# Altium schematic sheet 11-DPLL-2.SchDoc
size B; SheetNumber: 10; SheetTotal: 12; SPICEModelCacheYEUHMWUF: <root> / <DocumentId>YEUHMWUF</DocumentId> / </root>
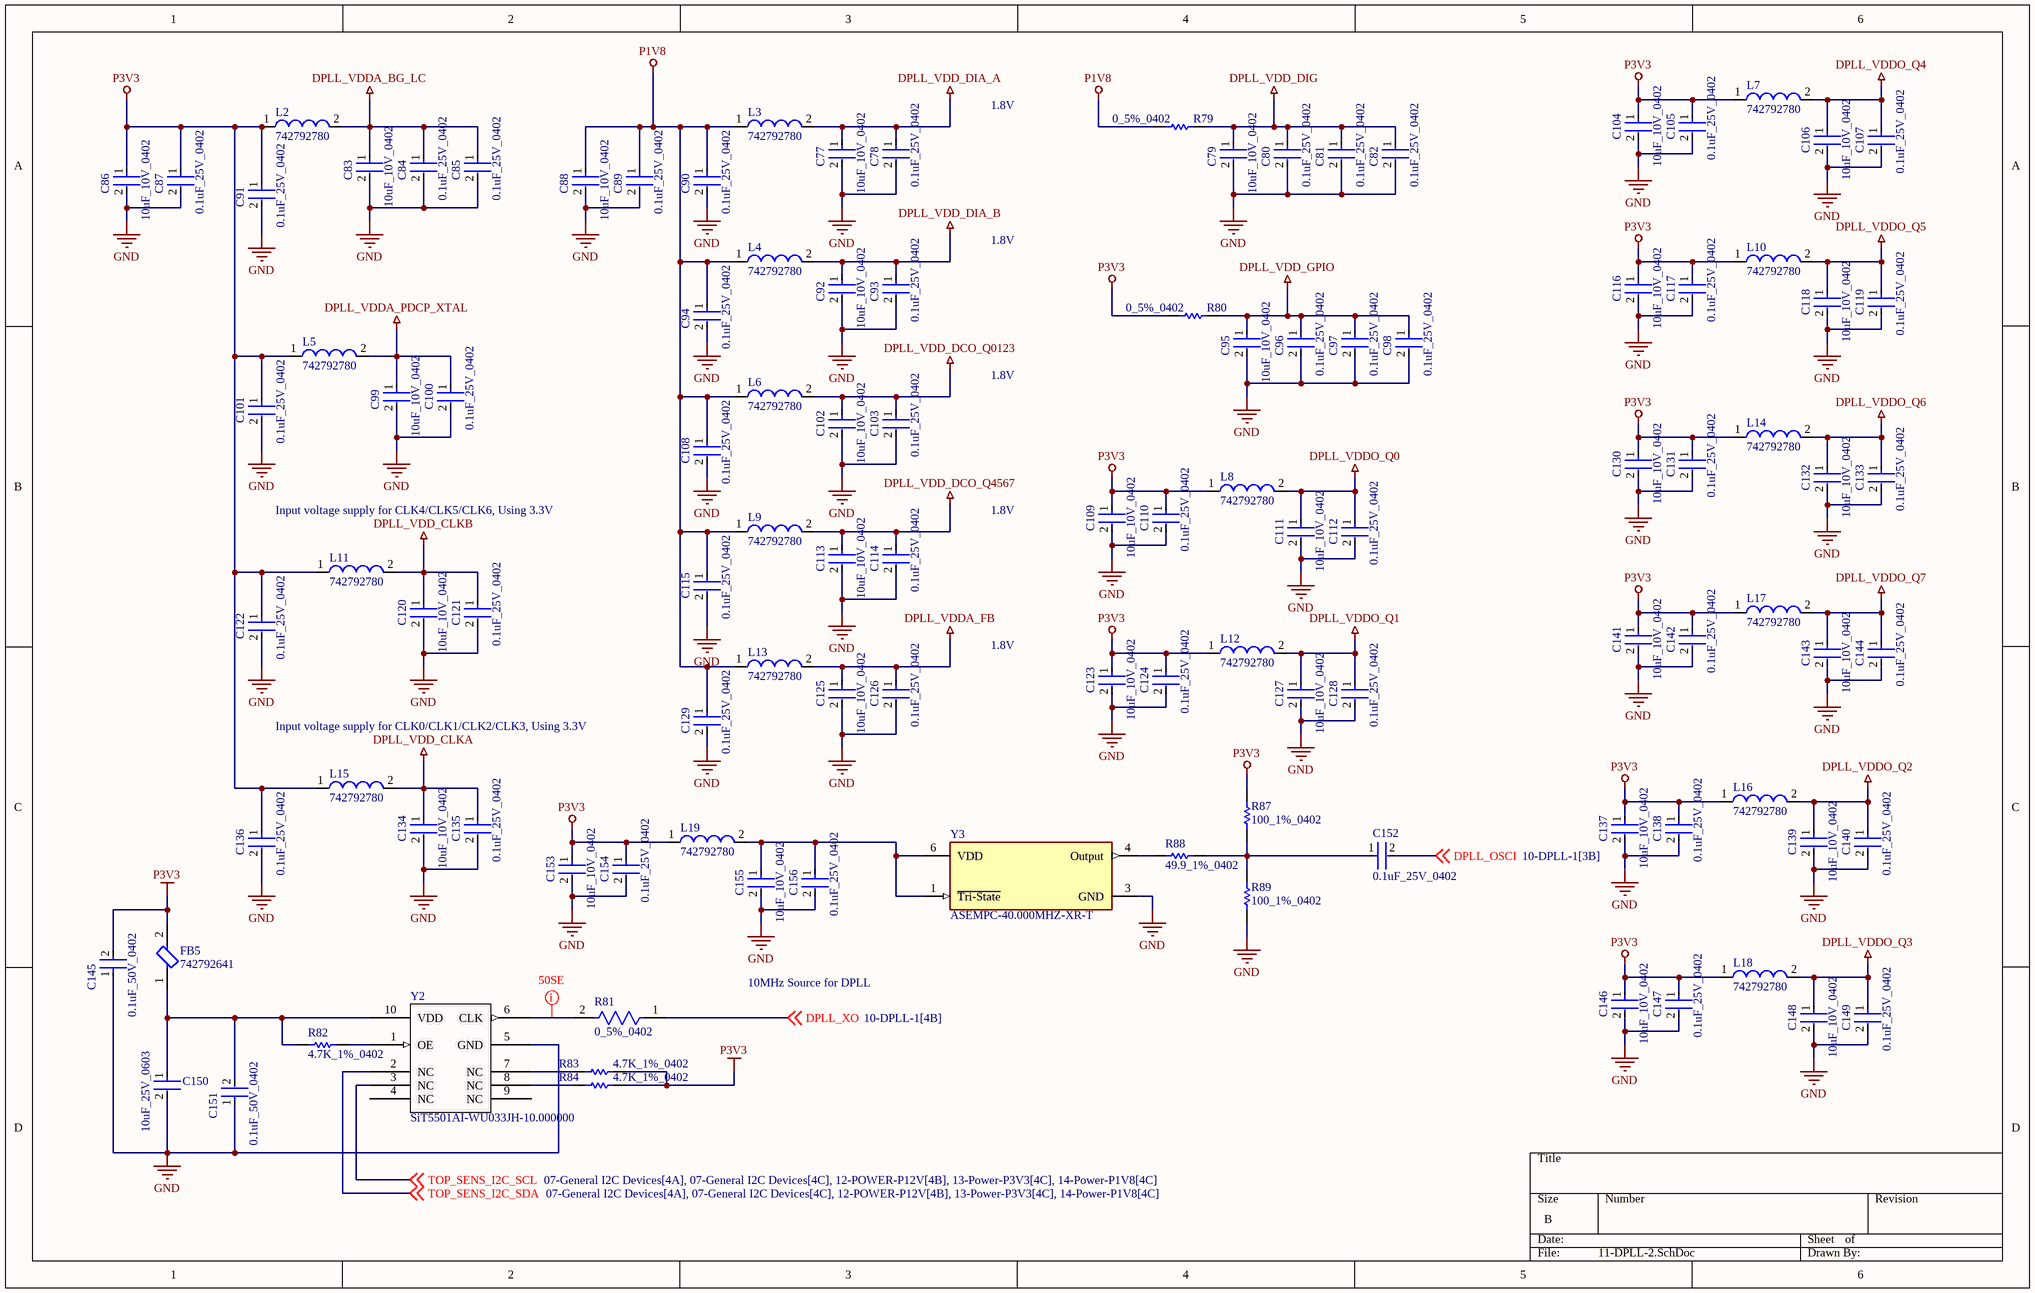
[diagram p0: 11-DPLL-2.SchDoc]

## Parts
C77  10uF_10V_0402  [FP-CL05A106MP5NUNC-MFG]
C78  0.1uF_25V_0402  [FP-0402-L_1_0_1-W_0_5_0_1-IPC_C]
C79  10uF_10V_0402  [FP-CL05A106MP5NUNC-MFG]
C80  0.1uF_25V_0402  [FP-0402-L_1_0_1-W_0_5_0_1-IPC_C]
C81  0.1uF_25V_0402  [FP-0402-L_1_0_1-W_0_5_0_1-IPC_C]
C82  0.1uF_25V_0402  [FP-0402-L_1_0_1-W_0_5_0_1-IPC_C]
C83  10uF_10V_0402  [FP-CL05A106MP5NUNC-MFG]
C84  0.1uF_25V_0402  [FP-0402-L_1_0_1-W_0_5_0_1-IPC_C]
C85  0.1uF_25V_0402  [FP-0402-L_1_0_1-W_0_5_0_1-IPC_C]
C86  10uF_10V_0402  [FP-CL05A106MP5NUNC-MFG]
C87  0.1uF_25V_0402  [FP-0402-L_1_0_1-W_0_5_0_1-IPC_C]
C88  10uF_10V_0402  [FP-CL05A106MP5NUNC-MFG]
C89  0.1uF_25V_0402  [FP-0402-L_1_0_1-W_0_5_0_1-IPC_C]
C90  0.1uF_25V_0402  [FP-0402-L_1_0_1-W_0_5_0_1-IPC_C]
C91  0.1uF_25V_0402  [FP-0402-L_1_0_1-W_0_5_0_1-IPC_C]
C92  10uF_10V_0402  [FP-CL05A106MP5NUNC-MFG]
C93  0.1uF_25V_0402  [FP-0402-L_1_0_1-W_0_5_0_1-IPC_C]
C94  0.1uF_25V_0402  [FP-0402-L_1_0_1-W_0_5_0_1-IPC_C]
C95  10uF_10V_0402  [FP-CL05A106MP5NUNC-MFG]
C96  0.1uF_25V_0402  [FP-0402-L_1_0_1-W_0_5_0_1-IPC_C]
C97  0.1uF_25V_0402  [FP-0402-L_1_0_1-W_0_5_0_1-IPC_C]
C98  0.1uF_25V_0402  [FP-0402-L_1_0_1-W_0_5_0_1-IPC_C]
C99  10uF_10V_0402  [FP-CL05A106MP5NUNC-MFG]
C100  0.1uF_25V_0402  [FP-0402-L_1_0_1-W_0_5_0_1-IPC_C]
C101  0.1uF_25V_0402  [FP-0402-L_1_0_1-W_0_5_0_1-IPC_C]
C102  10uF_10V_0402  [FP-CL05A106MP5NUNC-MFG]
C103  0.1uF_25V_0402  [FP-0402-L_1_0_1-W_0_5_0_1-IPC_C]
C104  10uF_10V_0402  [FP-CL05A106MP5NUNC-MFG]
C105  0.1uF_25V_0402  [FP-0402-L_1_0_1-W_0_5_0_1-IPC_C]
C106  10uF_10V_0402  [FP-CL05A106MP5NUNC-MFG]
C107  0.1uF_25V_0402  [FP-0402-L_1_0_1-W_0_5_0_1-IPC_C]
C108  0.1uF_25V_0402  [FP-0402-L_1_0_1-W_0_5_0_1-IPC_C]
C109  10uF_10V_0402  [FP-CL05A106MP5NUNC-MFG]
C110  0.1uF_25V_0402  [FP-0402-L_1_0_1-W_0_5_0_1-IPC_C]
C111  10uF_10V_0402  [FP-CL05A106MP5NUNC-MFG]
C112  0.1uF_25V_0402  [FP-0402-L_1_0_1-W_0_5_0_1-IPC_C]
C113  10uF_10V_0402  [FP-CL05A106MP5NUNC-MFG]
C114  0.1uF_25V_0402  [FP-0402-L_1_0_1-W_0_5_0_1-IPC_C]
C115  0.1uF_25V_0402  [FP-0402-L_1_0_1-W_0_5_0_1-IPC_C]
C116  10uF_10V_0402  [FP-CL05A106MP5NUNC-MFG]
C117  0.1uF_25V_0402  [FP-0402-L_1_0_1-W_0_5_0_1-IPC_C]
C118  10uF_10V_0402  [FP-CL05A106MP5NUNC-MFG]
C119  0.1uF_25V_0402  [FP-0402-L_1_0_1-W_0_5_0_1-IPC_C]
C120  10uF_10V_0402  [FP-CL05A106MP5NUNC-MFG]
C121  0.1uF_25V_0402  [FP-0402-L_1_0_1-W_0_5_0_1-IPC_C]
C122  0.1uF_25V_0402  [FP-0402-L_1_0_1-W_0_5_0_1-IPC_C]
C123  10uF_10V_0402  [FP-CL05A106MP5NUNC-MFG]
C124  0.1uF_25V_0402  [FP-0402-L_1_0_1-W_0_5_0_1-IPC_C]
C125  10uF_10V_0402  [FP-CL05A106MP5NUNC-MFG]
C126  0.1uF_25V_0402  [FP-0402-L_1_0_1-W_0_5_0_1-IPC_C]
C127  10uF_10V_0402  [FP-CL05A106MP5NUNC-MFG]
C128  0.1uF_25V_0402  [FP-0402-L_1_0_1-W_0_5_0_1-IPC_C]
C129  0.1uF_25V_0402  [FP-0402-L_1_0_1-W_0_5_0_1-IPC_C]
C130  10uF_10V_0402  [FP-CL05A106MP5NUNC-MFG]
C131  0.1uF_25V_0402  [FP-0402-L_1_0_1-W_0_5_0_1-IPC_C]
C132  10uF_10V_0402  [FP-CL05A106MP5NUNC-MFG]
C133  0.1uF_25V_0402  [FP-0402-L_1_0_1-W_0_5_0_1-IPC_C]
C134  10uF_10V_0402  [FP-CL05A106MP5NUNC-MFG]
C135  0.1uF_25V_0402  [FP-0402-L_1_0_1-W_0_5_0_1-IPC_C]
C136  0.1uF_25V_0402  [FP-0402-L_1_0_1-W_0_5_0_1-IPC_C]
C137  10uF_10V_0402  [FP-CL05A106MP5NUNC-MFG]
C138  0.1uF_25V_0402  [FP-0402-L_1_0_1-W_0_5_0_1-IPC_C]
C139  10uF_10V_0402  [FP-CL05A106MP5NUNC-MFG]
C140  0.1uF_25V_0402  [FP-0402-L_1_0_1-W_0_5_0_1-IPC_C]
C141  10uF_10V_0402  [FP-CL05A106MP5NUNC-MFG]
C142  0.1uF_25V_0402  [FP-0402-L_1_0_1-W_0_5_0_1-IPC_C]
C143  10uF_10V_0402  [FP-CL05A106MP5NUNC-MFG]
C144  0.1uF_25V_0402  [FP-0402-L_1_0_1-W_0_5_0_1-IPC_C]
C145  0.1uF_50V_0402  [FP-C1005-050-0_05-IPC_C]
C146  10uF_10V_0402  [FP-CL05A106MP5NUNC-MFG]
C147  0.1uF_25V_0402  [FP-0402-L_1_0_1-W_0_5_0_1-IPC_C]
C148  10uF_10V_0402  [FP-CL05A106MP5NUNC-MFG]
C149  0.1uF_25V_0402  [FP-0402-L_1_0_1-W_0_5_0_1-IPC_C]
C150  10uF_25V_0603  [FP-CL10-IPC_C]
C151  0.1uF_50V_0402  [FP-C1005-050-0_05-IPC_C]
C152  0.1uF_25V_0402  [FP-0402-L_1_0_1-W_0_5_0_1-IPC_C]
C153  10uF_10V_0402  [FP-CL05A106MP5NUNC-MFG]
C154  0.1uF_25V_0402  [FP-0402-L_1_0_1-W_0_5_0_1-IPC_C]
C155  10uF_10V_0402  [FP-CL05A106MP5NUNC-MFG]
C156  0.1uF_25V_0402  [FP-0402-L_1_0_1-W_0_5_0_1-IPC_C]
FB5  742792641  [FP-742792641-MFG]
L2  742792780  [SMD-0402]
L3  742792780  [SMD-0402]
L4  742792780  [SMD-0402]
L5  742792780  [SMD-0402]
L6  742792780  [SMD-0402]
L7  742792780  [SMD-0402]
L8  742792780  [SMD-0402]
L9  742792780  [SMD-0402]
L10  742792780  [SMD-0402]
L11  742792780  [SMD-0402]
L12  742792780  [SMD-0402]
L13  742792780  [SMD-0402]
L14  742792780  [SMD-0402]
L15  742792780  [SMD-0402]
L16  742792780  [SMD-0402]
L17  742792780  [SMD-0402]
L18  742792780  [SMD-0402]
L19  742792780  [SMD-0402]
R79  0_5%_0402  [RESC1005X40X25LL10T10]
R80  0_5%_0402  [RESC1005X40X25LL10T10]
R81  0_5%_0402  [FP-AC0402-0_37-IPC_B]
R82  4.7K_1%_0402  [RESC1005X40X25NL10T10]
R83  4.7K_1%_0402  [RESC1005X40X25NL10T10]
R84  4.7K_1%_0402  [RESC1005X40X25NL10T10]
R87  100_1%_0402  [RESC1005X40X25ML05T10]
R88  49.9_1%_0402  [RESC1005X40X25NL10T10]
R89  100_1%_0402  [RESC1005X40X25ML05T10]
Y2  Manufacturer Part Number: SiT5501AI-WU033JH-10.000000  [SITIME_SPL-086-CQFN-010-C07050_REV_DRAFT]  (hidden comment: SiTime_SiT5501AC-WU-33E0-10T)
Y3  ASEMPC-40.000MHZ-XR-T  [FP-ASEMP-CMOS-MFG]

## Nets
DPLL_VDD_CLKA: C134.1 C135.1 L15.2
DPLL_VDD_CLKB: C120.1 C121.1 L11.2
DPLL_VDD_DCO_Q0123: C102.1 C103.1 L6.2
DPLL_VDD_DCO_Q4567: C113.1 C114.1 L9.2
DPLL_VDD_DIA_A: C77.1 C78.1 L3.2
DPLL_VDD_DIA_B: C92.1 C93.1 L4.2
DPLL_VDD_DIG: C79.1 C80.1 C81.1 C82.1 R79.2
DPLL_VDD_GPIO: C95.1 C96.1 C97.1 C98.1 R80.2
DPLL_VDDA_BG_LC: C83.1 C84.1 C85.1 L2.2
DPLL_VDDA_FB: C125.1 C126.1 L13.2
DPLL_VDDA_PDCP_XTAL: C99.1 C100.1 L5.2
DPLL_VDDO_Q0: C111.1 C112.1 L8.2
DPLL_VDDO_Q1: C127.1 C128.1 L12.2
DPLL_VDDO_Q2: C139.1 C140.1 L16.2
DPLL_VDDO_Q3: C148.1 C149.1 L18.2
DPLL_VDDO_Q4: C106.1 C107.1 L7.2
DPLL_VDDO_Q5: C118.1 C119.1 L10.2
DPLL_VDDO_Q6: C132.1 C133.1 L14.2
DPLL_VDDO_Q7: C143.1 C144.1 L17.2
GND: C77.2 C78.2 C79.2 C80.2 C81.2 C82.2 C83.2 C84.2 C85.2 C86.2 C87.2 C88.2 C89.2 C90.2 C91.2 C92.2 C93.2 C94.2 C95.2 C96.2 C97.2 C98.2 C99.2 C100.2 C101.2 C102.2 C103.2 C104.2 C105.2 C106.2 C107.2 C108.2 C109.2 C110.2 C111.2 C112.2 C113.2 C114.2 C115.2 C116.2 C117.2 C118.2 C119.2 C120.2 C121.2 C122.2 C123.2 C124.2 C125.2 C126.2 C127.2 C128.2 C129.2 C130.2 C131.2 C132.2 C133.2 C134.2 C135.2 C136.2 C137.2 C138.2 C139.2 C140.2 C141.2 C142.2 C143.2 C144.2 C145.1 C146.2 C147.2 C148.2 C149.2 C150.2 C151.1 C153.2 C154.2 C155.2 C156.2 R89.1 Y2.5(GND) Y3.3(GND)
P1V8: C88.1 C89.1 C90.1 C94.1 C108.1 C115.1 C129.1 L3.1 L4.1 L6.1 L9.1 L13.1 R79.1
P3V3: C86.1 C87.1 C91.1 C101.1 C104.1 C105.1 C109.1 C110.1 C116.1 C117.1 C122.1 C123.1 C124.1 C130.1 C131.1 C136.1 C137.1 C138.1 C141.1 C142.1 C145.2 C146.1 C147.1 C153.1 C154.1 FB5.2 L2.1 L5.1 L7.1 L8.1 L10.1 L11.1 L12.1 L14.1 L15.1 L16.1 L17.1 L18.1 L19.1 R80.1 R83.2 R84.2 R87.2
DPLL_OSCI: C152.2 ; off-sheet DPLL_OSCI
DPLL_XO: R81.1 ; off-sheet DPLL_XO
TOP_SENS_I2C_SCL: Y2.3(NC) ; off-sheet TOP_SENS_I2C_SCL
TOP_SENS_I2C_SDA: Y2.2(NC) ; off-sheet TOP_SENS_I2C_SDA
NetC150_1: C150.1 C151.2 FB5.1 R82.1 Y2.10(VDD)
NetC152_1: C152.1 R87.1 R88.2 R89.2
NetC155_1: C155.1 C156.1 L19.2 Y3.1(~{Tri-State}) Y3.6(VDD)
NetR81_2: R81.2 Y2.6(CLK)
NetR82_2: R82.2 Y2.1(OE)
NetR83_1: R83.1 Y2.7(NC)
NetR84_1: R84.1 Y2.8(NC)
NetR88_1: R88.1 Y3.4(Output)

Not connected (* = marked no-connect by the designer): Y2 4(NC) 9(NC)

## Layout directives
net class 50SE: NetR81_2

## Notes on the sheet
- 1.8V
- Input voltage supply for CLK4/CLK5/CLK6, Using 3.3V
- Input voltage supply for CLK0/CLK1/CLK2/CLK3, Using 3.3V
- 10MHz Source for DPLL

## Library data of the parts
C77 C79 C83 C86 C88 C92 C95 C99 C102 C104 C106 C109 C111 C113 C116 C118 C120 C123 C125 C127 C130 C132 C134 C137 C139 C141 C143 C146 C148 C153 C155 = CMP-13271-000002-1: CAP CER 10UF 10V X5R 0402; Manufacturer Part Number: CL05A106MP5NUNC; Manufacturer: Samsung; Temperature Coefficient: 15%; Tolerance: 20%; Material: Ceramic; Octopart: https://octopart.com/cl05a106mp5nunc-samsung-22457395; Voltage Rating: 10V; RoHS: TRUE; Value: 10uF; Height: 0.7mm; Digikey Description: CAP CER 10UF 10V X5R 0402; Automotive: No; Package: CL05A106MP5NUNC; Device Class L1: Passive Components; Capacitance: 10uF; Temperature Range High: +85°C; ComponentLink2Description: Datasheet; Device Class L2: Capacitors; Temperature Characteristic: X5R; Temperature: -55°C to +85°C; ComponentLink2URL: http://www.samsungsem.com/kr/support/product-search/mlcc/__icsFiles/afieldfile/2019/05/10/19-CL05A106MP5NUNC.pdf; Device Class L3: Ceramic Capacitors; Category: Cap; Temperature Range Low: -55°C; Ipc Land Pattern Name: CAPC10050X50; Lead Free: Yes
C78 C80-C82 C84 C85 C87 C89-C91 C93 C94 C96-C98 C100 C101 C103 C105 C107 C108 C110 C112 C114 C115 C117 C119 C121 C122 C124 C126 C128 C129 C131 C133 C135 C136 C138 C140 C142 C144 C147 C149 C152 C154 C156 = CMP-2008-02519-2: General Purpose Ceramic Capacitor, 0402, 100nF, 10%, X7R, 15%, 25V; Package Quantity: 1; Capacitance: 100nF; Min Operating Temperature: -55°C; Voltage: 25V; Voltage Rating: 25V; Construction: Flat; Max Operating Temperature: 125°C; Radiation Hardening: No; Depth: 0.5mm; Thickness: 0.022inch; Voltage Rating (DC): 25V; Number of Pins: 2; Lead Free: Lead Free; Series: -; REACH SVHC: No SVHC; Length: 1mm; Dielectric: X7R; RoHS Compliant: Yes; Mount: Surface Mount; Packaging: Tape and Reel; Case/Package: 0402; Case Code (Imperial): 0402; Termination: SMD/SMT; Width: 0.02inch; Case Code (Metric): 1005; Tolerance: 10%
C145 C151 = CMP-2000-05393-2: Multilayer Ceramic Capacitors 100nF ±10% 50V X7R SMD 0402; Voltage: 50V; Dielectric Material: Ceramic; Min Operating Temperature: -55°C; Depth: 0.5mm; Radiation Hardening: No; RoHS Compliant: Yes; Voltage Rating (DC): 50V; Lead Free: Lead Free; Resistor Type: Ceramic; Height: 0.5mm; Dielectric: X7R; Thickness: 0.022inch; Case/Package: 0402; Case Code (Metric): 1005; Termination: SMD/SMT; Capacitance: 100nF; Packaging: Tape and Reel; Max Operating Temperature: 125°C; Mount: Surface Mount; Package Quantity: 1; Width: 0.02inch; Weight: 2.3E-05oz; Voltage Rating: 50V; Tolerance: 10%; Construction: Flat; Case Code (Imperial): 0402; Length: 1mm; REACH SVHC: No SVHC; Series: C
C150 = CMP-13271-004224-1: Cap Ceramic 10uF 25V X5R ±20% Pad SMD 0603 +85°C T/R; Width: 0.031inch; Voltage Rating: 25V; Length: 0.063inch; Case Code (Metric): 1608; Dielectric: X5R; Termination: Wraparound; Capacitance: 10uF; Lead Free: Lead Free; Mount: Surface Mount; Package Quantity: 1; Case Code (Imperial): 0603; Thickness: 0.035inch; Packaging: Tape and Reel; Contact Plating: Tin; Min Operating Temperature: -55°C; Tolerance: 20%; Max Operating Temperature: 85°C; Case/Package: 0603
FB5 = CMP-0220-00171-2: FERRITE BEAD 300 OHM 0603 1LN; Inductance: 18nH; Max DC Current: 2A; Number of Lines: 1; Test Frequency: 100MHz; Impedance: 300R; DC Resistance (DCR): 150mR; Tolerance: 25%; Case Code (Metric): 1608; Core Material: Ferrite; Length: 1.6mm; Lead Free: Lead Free; Series: WE-CBF; Min Operating Temperature: -55°C; RoHS Compliant: Yes; Case/Package: SMD/SMT; Material: Ferrite; Max Operating Temperature: 125°C; Termination: SMD/SMT; Packaging: Tape and Reel; Weight: 0.000141oz; Case Code (Imperial): 0603; Width: 0.8mm; Mount: Surface Mount; Max Current Rating: 2A; Package Quantity: 1; Depth: 0.8mm; Current Rating: 2A; Height: 0.8mm
L2-L19 = CMP-0220-00137-1: SMD EMI Suppression Ferrite Bead WE-CBF, Z = 220 Ohm; Impedance: 220 Ohm; PackageVersion: 2009; DatasheetVersion: ver 4, Jul-2009; PackageDescription: Chip Inductor, 2-Leads, Body 1.0 x 0.5 mm; ComponentLink1URL: http://www.we-online.com; ComponentLink1Description: Manufacturer Link; ComponentLink2URL: http://www.we-online.de/katalog/media/pdf/742792780.pdf; PackageReference: SMD-0402; ComponentLink2Description: Datasheet
R79 R80 = CMP-2002-04569-1: Manufacturer: KOA Speer; Part Number: RK73Z1ETTP
R81 = CMP-2002-01772-2: RESISTOR 0402 JUMPER ZERO OHM; Voltage Rating: 50V; Temperature Coefficient: 200ppm/°C; Tolerance: 1%; Power Rating: 62.5mW; Resistance: 0R; Min Operating Temperature: -55°C; Termination: SMD/SMT; Case/Package: 0402; Case Code (Imperial): 0402; Packaging: Tape and Reel; Case Code (Metric): 1005; Max Operating Temperature: 155°C; Series: AC
R82-R84 = CMP-2002-05217-1: Manufacturer: Bourns; Part Number: CR0402-FX-4701GLF
R87 R89 = CMP-2002-06458-1: Part Number: ERJ-U02F1000X; Manufacturer: Panasonic
R88 = CMP-2002-04448-1: Part Number: RK73H1ETTP49R9F; Manufacturer: KOA Speer
Y2 = CMP-OSC-00029-2: OSC, MEMS, STRATUM 3E, 10.000MHZ, 10PPB STAB, LVCMOS, 3.3V, O/P EN, 7.0X5.0X2.2MM, CQFN-10; Manufacturer: SiTime; Frequency: 10 MHz; Voltage - Supply: 3.3 V; Type: OCXO; Category: Oscillators; Max Operating Temperature: 70°C; Min Operating Temperature: -20°C; Height: 2.20mm (max); Case/Package: 10 Lead QFN; Output: LVCMOS; Mounting Type: Surface Mount; Frequency Stability: ±10 ppb; RoHS: Yes
Y3 = CMP-27762-012912-1: MEMS Oscillator 40MHz ±25ppm CMOS 2.25V~3.6V 6-SMD 3.2mm x 2.5mm; Max Supply Current: 35mA; Max Duty Cycle: 55%; Operating Supply Voltage: 3.3V; Max Supply Voltage: 3.6V; Load Capacitance: 15pF; Min Supply Voltage: 2.25V; Termination: SMD/SMT; Frequency: 40MHz; Length: 0.126inch; Case/Package: SMD/SMT; Max Operating Temperature: 105°C; RoHS Compliant: Yes; Mount: Surface Mount; Packaging: Tape and Reel; Number of Pins: 6; Width: 0.098inch; Min Operating Temperature: -40°C; Frequency Stability: 25ppm; Height: 0.035inch; Package Quantity: 1000